# Altium schematic sheet LocalKillTop.SchDoc
size A
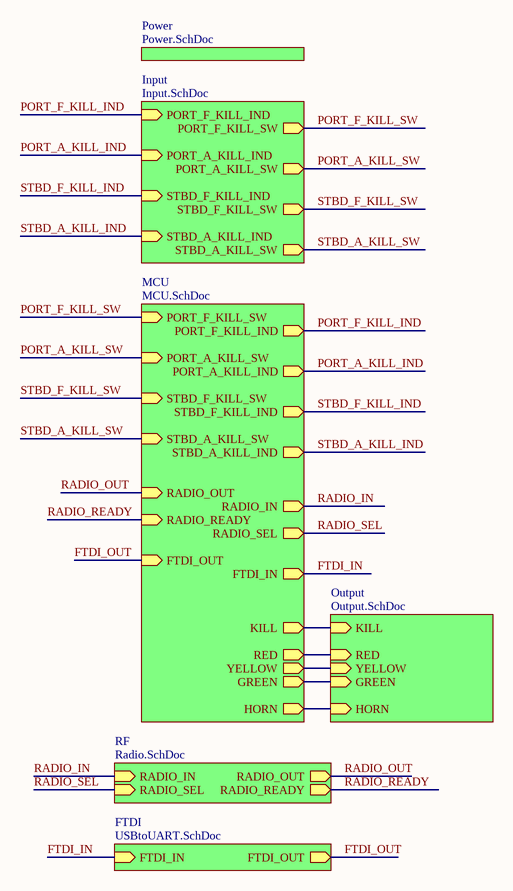
[diagram p0: LocalKillTop.SchDoc]

## Sub-sheets
FTDI = USBtoUART.SchDoc: FTDI_IN (in), FTDI_OUT (out)
Input = Input.SchDoc: PORT_F_KILL_IND (in), PORT_A_KILL_IND (in), STBD_F_KILL_IND (in), STBD_A_KILL_IND (in), PORT_F_KILL_SW (out), PORT_A_KILL_SW (out), STBD_F_KILL_SW (out), STBD_A_KILL_SW (out)
MCU = MCU.SchDoc: PORT_F_KILL_IND (out), PORT_F_KILL_SW (in), PORT_A_KILL_IND (out), PORT_A_KILL_SW (in), STBD_F_KILL_IND (out), STBD_F_KILL_SW (in), STBD_A_KILL_IND (out), STBD_A_KILL_SW (in), RADIO_OUT (in), RADIO_IN (out), RADIO_READY (in), RADIO_SEL (out), FTDI_OUT (in), FTDI_IN (out), KILL (out), RED (out), GREEN (out), YELLOW (out), HORN (out)
Output = Output.SchDoc: KILL (in), RED (in), YELLOW (in), GREEN (in), HORN (in)
Power = Power.SchDoc: no entries
RF = Radio.SchDoc: RADIO_IN (in), RADIO_OUT (out), RADIO_SEL (in), RADIO_READY (out)

## Nets
FTDI_IN: sheet FTDI/FTDI_IN, sheet MCU/FTDI_IN
FTDI_OUT: sheet FTDI/FTDI_OUT, sheet MCU/FTDI_OUT
PORT_A_KILL_IND: sheet Input/PORT_A_KILL_IND, sheet MCU/PORT_A_KILL_IND
PORT_A_KILL_SW: sheet Input/PORT_A_KILL_SW, sheet MCU/PORT_A_KILL_SW
PORT_F_KILL_IND: sheet Input/PORT_F_KILL_IND, sheet MCU/PORT_F_KILL_IND
PORT_F_KILL_SW: sheet Input/PORT_F_KILL_SW, sheet MCU/PORT_F_KILL_SW
RADIO_IN: sheet RF/RADIO_IN, sheet MCU/RADIO_IN
RADIO_OUT: sheet RF/RADIO_OUT, sheet MCU/RADIO_OUT
RADIO_READY: sheet RF/RADIO_READY, sheet MCU/RADIO_READY
RADIO_SEL: sheet RF/RADIO_SEL, sheet MCU/RADIO_SEL
STBD_A_KILL_IND: sheet Input/STBD_A_KILL_IND, sheet MCU/STBD_A_KILL_IND
STBD_A_KILL_SW: sheet Input/STBD_A_KILL_SW, sheet MCU/STBD_A_KILL_SW
STBD_F_KILL_IND: sheet Input/STBD_F_KILL_IND, sheet MCU/STBD_F_KILL_IND
STBD_F_KILL_SW: sheet Input/STBD_F_KILL_SW, sheet MCU/STBD_F_KILL_SW
(unnamed): sheet Output/KILL, sheet MCU/KILL
(unnamed): sheet Output/RED, sheet MCU/RED
(unnamed): sheet Output/YELLOW, sheet MCU/YELLOW
(unnamed): sheet Output/GREEN, sheet MCU/GREEN
(unnamed): sheet Output/HORN, sheet MCU/HORN